# Altium project PCB_Project.PrjPcb (part 2 of 2)
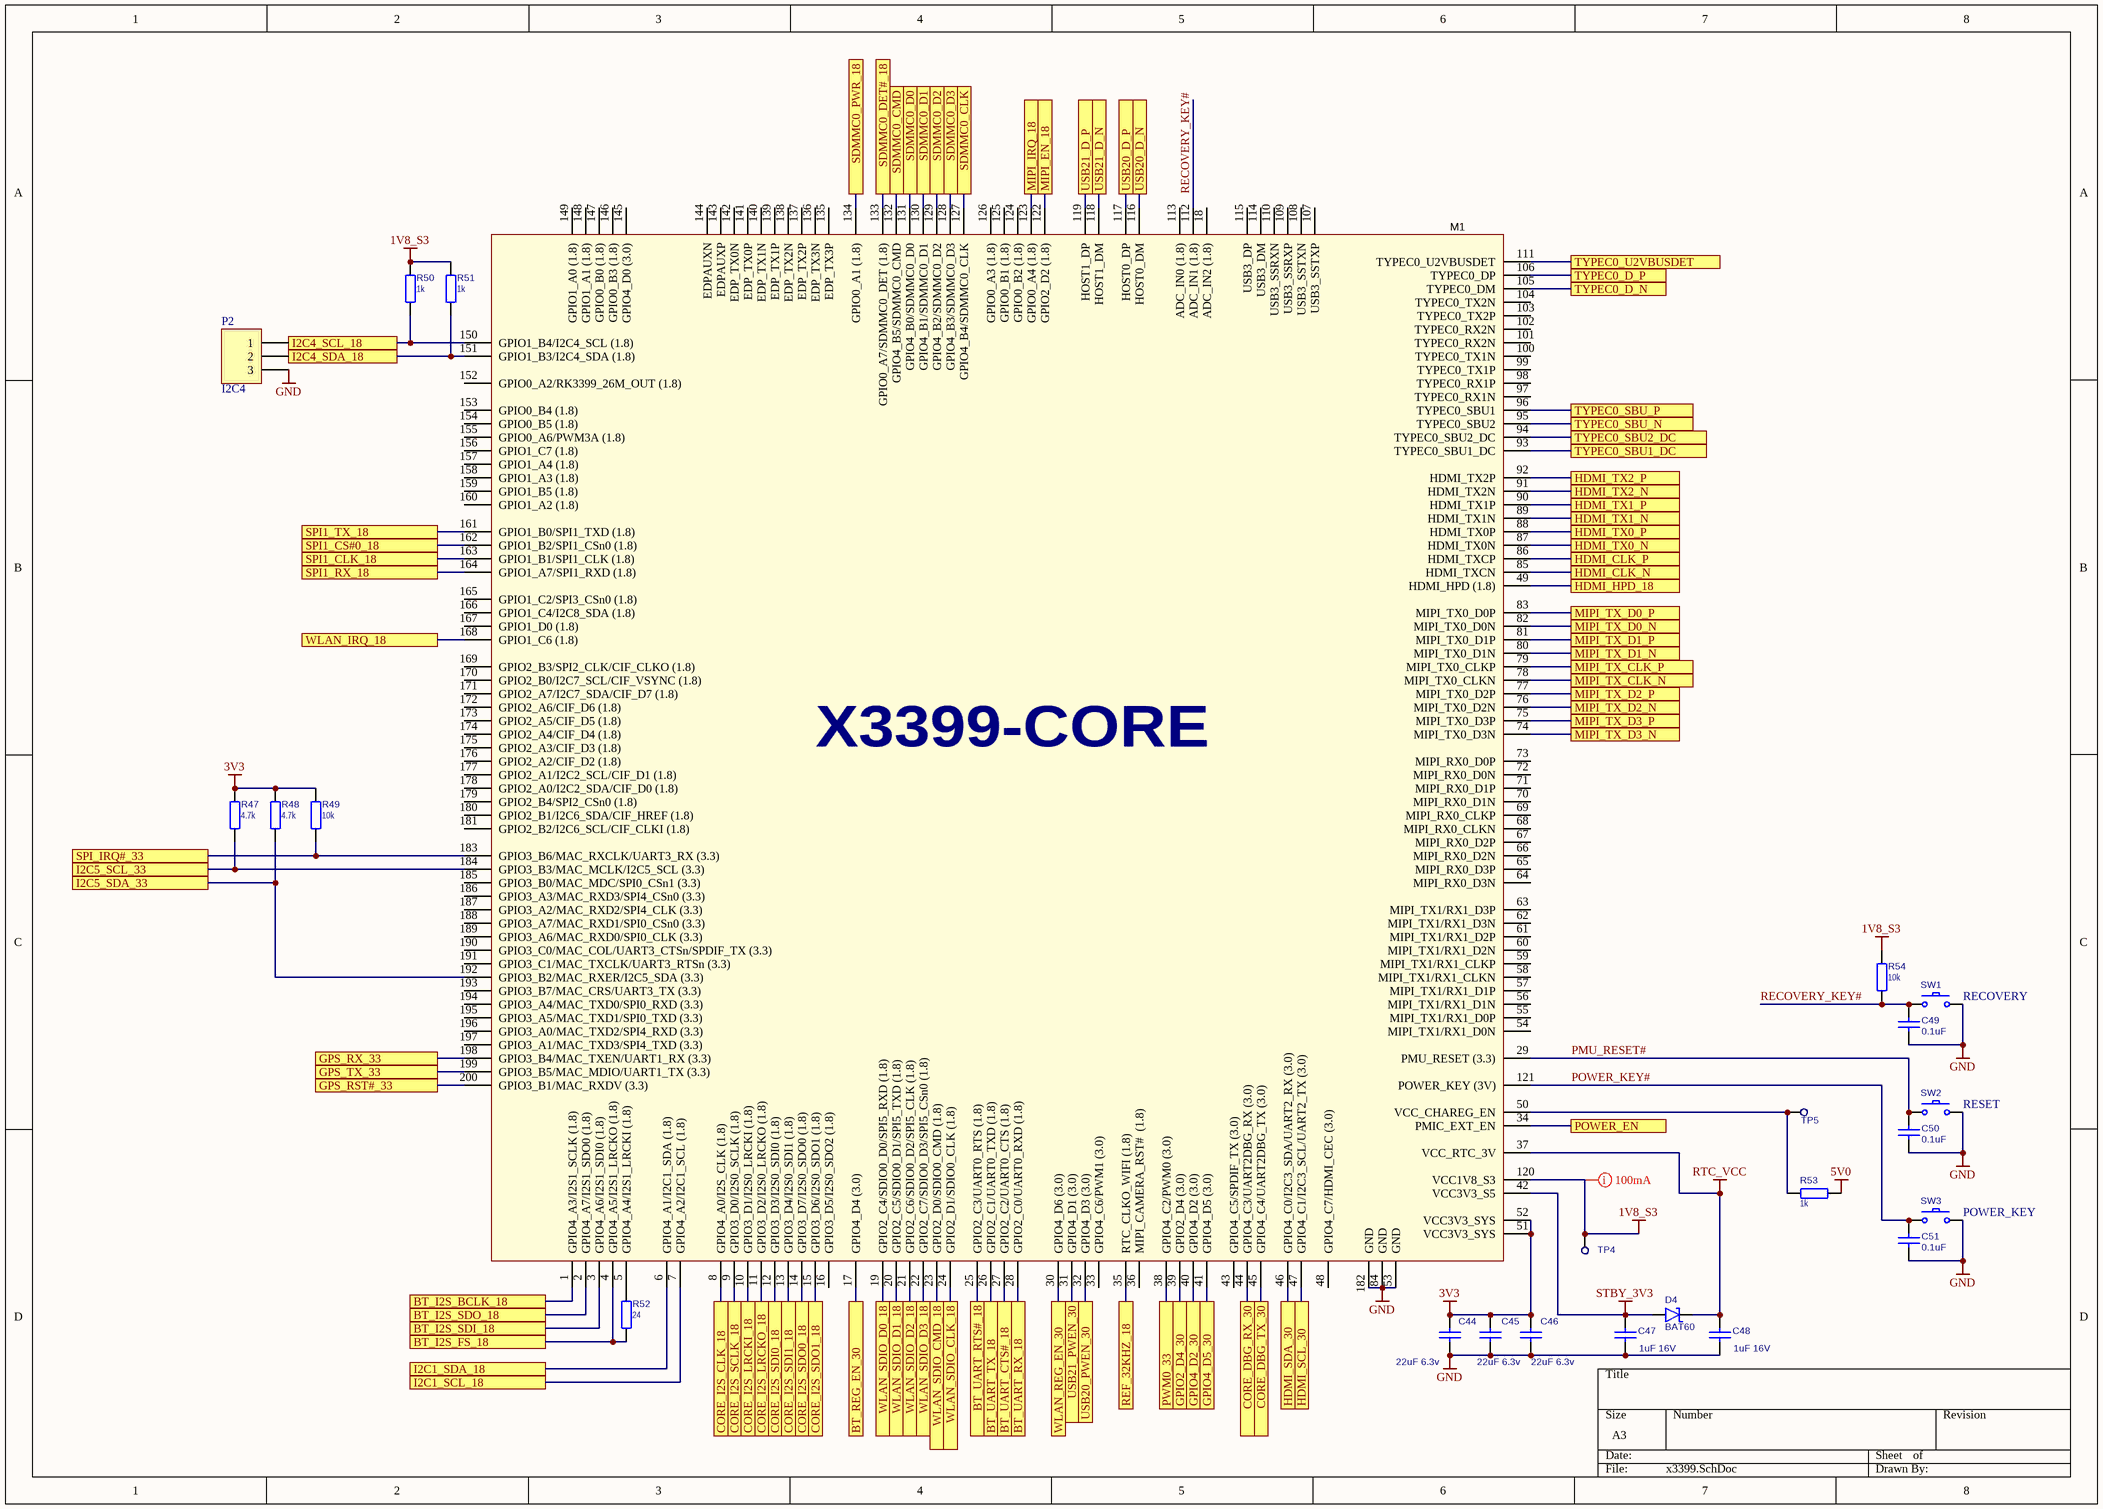
[diagram p10: x3399.SchDoc]

## Nets that join several sheets
1V8_S3: sdcard (R93.2), x3399 (5 pins)
3V3: sensors (L17.1), audio (L12.2), connectivity (L9.2), power (9 pins), x3399 (8 pins)
5V0: dsi_csi (L19.2 L20.1), sdcard (L18.1), audio (P3.23 P3.24 R66.1 R67.2), usb (L1.1 L2.2 L3.2), hdmi (L4.2), power (9 pins), x3399 (R53.1)
GND: dsi_csi (28 pins), sdcard (7 pins), sensors (14 pins), audio (45 pins), connectivity (76 pins), usb (43 pins), debug (10 pins), hdmi (23 pins), power (53 pins), x3399 (15 pins)
STBY_3V3: sensors (L16.2), power (6 pins), x3399 (C47.2 D4.1 M1.42)
BT_I2S_BCLK_18: connectivity (R61.7), x3399 (M1.1)
BT_I2S_FS_18: connectivity (R61.5), x3399 (M1.4 R52.2)
BT_I2S_SDI_18: connectivity (R61.3), x3399 (M1.3)
BT_I2S_SDO_18: connectivity (R61.1), x3399 (M1.2)
BT_REG_EN_30: connectivity (R55.1), x3399 (M1.17)
BT_UART_CTS#_18: connectivity (R60.3), x3399 (M1.27)
BT_UART_RTS#_18: connectivity (R60.7), x3399 (M1.25)
BT_UART_RX_18: connectivity (R60.1), x3399 (M1.28)
BT_UART_TX_18: connectivity (R60.5), x3399 (M1.26)
CORE_DBG_RX_30: debug (R18.1 R19.1), x3399 (M1.44)
CORE_DBG_TX_30: debug (R17.1), x3399 (M1.45)
CORE_I2S_CLK_18: audio (R69.1), x3399 (M1.8)
CORE_I2S_LRCKI_18: audio (R69.5), x3399 (M1.10)
CORE_I2S_LRCKO_18: audio (R69.7), x3399 (M1.11)
CORE_I2S_SCLK_18: audio (R69.3), x3399 (M1.9)
CORE_I2S_SDI0_18: audio (R68.1), x3399 (M1.12)
CORE_I2S_SDI1_18: audio (R68.3), x3399 (M1.13)
CORE_I2S_SDO0_18: audio (R68.5), x3399 (M1.14)
CORE_I2S_SDO1_18: audio (R68.7), x3399 (M1.15)
GPIO2_D4_30: dsi_csi (CN7.10), x3399 (M1.39)
GPIO4_D2_30: dsi_csi (CN7.8), x3399 (M1.40)
GPIO4_D5_30: dsi_csi (CN7.6), x3399 (M1.41)
GPS_RST#_33: sensors (M3.8 R86.1), x3399 (M1.200)
GPS_RX_33: sensors (R84.1), x3399 (M1.198)
GPS_TX_33: sensors (R85.1), x3399 (M1.199)
HDMI_CLK_N: hdmi (U10.10), x3399 (M1.85)
HDMI_CLK_P: hdmi (U10.9), x3399 (M1.86)
HDMI_HPD_18: hdmi (Q3.1 R25.1 Z2.2), x3399 (M1.49)
HDMI_SCL_30: hdmi (Q1.2 R20.1), x3399 (M1.47)
HDMI_SDA_30: hdmi (Q2.2 R21.1), x3399 (M1.46)
HDMI_TX0_N: hdmi (U10.7), x3399 (M1.87)
HDMI_TX0_P: hdmi (U10.6), x3399 (M1.88)
HDMI_TX1_N: hdmi (U9.10), x3399 (M1.89)
HDMI_TX1_P: hdmi (U9.9), x3399 (M1.90)
HDMI_TX2_N: hdmi (U9.7), x3399 (M1.91)
HDMI_TX2_P: hdmi (U9.6), x3399 (M1.92)
I2C1_SCL_18: dsi_csi (CN7.2 R95.2 U22.15), x3399 (M1.7)
I2C1_SDA_18: dsi_csi (CN7.4 R94.2 U22.16), x3399 (M1.6)
I2C5_SCL_33: audio (P3.19 U19.24), x3399 (M1.184 R47.1)
I2C5_SDA_33: audio (P3.20 U19.23), x3399 (M1.192 R48.2)
MIPI_EN_18: dsi_csi (R98.2 U22.2), x3399 (M1.122)
MIPI_IRQ_18: dsi_csi (R99.2 U22.33), x3399 (M1.123)
MIPI_TX_CLK_N: dsi_csi (U22.25), x3399 (M1.78)
MIPI_TX_CLK_P: dsi_csi (U22.24), x3399 (M1.79)
MIPI_TX_D0_N: dsi_csi (U22.20), x3399 (M1.82)
MIPI_TX_D0_P: dsi_csi (U22.19), x3399 (M1.83)
MIPI_TX_D1_N: dsi_csi (U22.22), x3399 (M1.80)
MIPI_TX_D1_P: dsi_csi (U22.21), x3399 (M1.81)
MIPI_TX_D2_N: dsi_csi (U22.28), x3399 (M1.76)
MIPI_TX_D2_P: dsi_csi (U22.27), x3399 (M1.77)
MIPI_TX_D3_N: dsi_csi (U22.30), x3399 (M1.74)
MIPI_TX_D3_P: dsi_csi (U22.29), x3399 (M1.75)
POWER_EN: power (R38.1), x3399 (M1.34)
PWM0_33: dsi_csi (CN7.12), x3399 (M1.38)
REF_32KHZ_18: connectivity (R65.1), x3399 (M1.35)
SDMMC0_CLK: sdcard (R90.2), x3399 (M1.127)
SDMMC0_CMD: sdcard (R91.2), x3399 (M1.132)
SDMMC0_D0: sdcard (R92.1), x3399 (M1.131)
SDMMC0_D1: sdcard (R92.3), x3399 (M1.130)
SDMMC0_D2: sdcard (R92.5), x3399 (M1.129)
SDMMC0_D3: sdcard (R92.7), x3399 (M1.128)
SDMMC0_DET#_18: sdcard (CN6.11 R93.1), x3399 (M1.133)
SDMMC0_PWR_18: sdcard (R88.1), x3399 (M1.134)
SPI1_CLK_18: audio (R81.3), x3399 (M1.163)
SPI1_CS#0_18: audio (R81.5), x3399 (M1.162)
SPI1_RX_18: audio (R81.1), x3399 (M1.164)
SPI1_TX_18: audio (R81.7), x3399 (M1.161)
SPI_IRQ#_33: audio (P3.17), x3399 (M1.183 R49.2)
TYPEC0_D_N: usb (U7.7), x3399 (M1.105)
TYPEC0_D_P: usb (U7.6), x3399 (M1.106)
TYPEC0_SBU1_DC: usb (R12.2), x3399 (M1.93)
TYPEC0_SBU2_DC: usb (R11.2), x3399 (M1.94)
TYPEC0_SBU_N: usb (C11.2), x3399 (M1.95)
TYPEC0_SBU_P: usb (C10.2), x3399 (M1.96)
TYPEC0_U2VBUSDET: usb (C12.1 R10.2 R13.2 Z1.2), x3399 (M1.111)
USB20_D_N: usb (U5.6), x3399 (M1.116)
USB20_D_P: usb (U5.4), x3399 (M1.117)
USB20_PWEN_30: usb (R8.1 U3.4), x3399 (M1.32)
USB21_D_N: usb (U6.6), x3399 (M1.118)
USB21_D_P: usb (U6.4), x3399 (M1.119)
USB21_PWEN_30: usb (R9.1 U4.4), x3399 (M1.31)
WLAN_IRQ_18: connectivity (M2.14 R59.2), x3399 (M1.168)
WLAN_REG_EN_30: connectivity (R57.1), x3399 (M1.30)
WLAN_SDIO_CLK_18: connectivity (R63.2), x3399 (M1.24)
WLAN_SDIO_CMD_18: connectivity (R62.2), x3399 (M1.23)
WLAN_SDIO_D0_18: connectivity (R64.2), x3399 (M1.19)
WLAN_SDIO_D1_18: connectivity (R64.4), x3399 (M1.20)
WLAN_SDIO_D2_18: connectivity (R64.6), x3399 (M1.21)
WLAN_SDIO_D3_18: connectivity (R64.8), x3399 (M1.22)